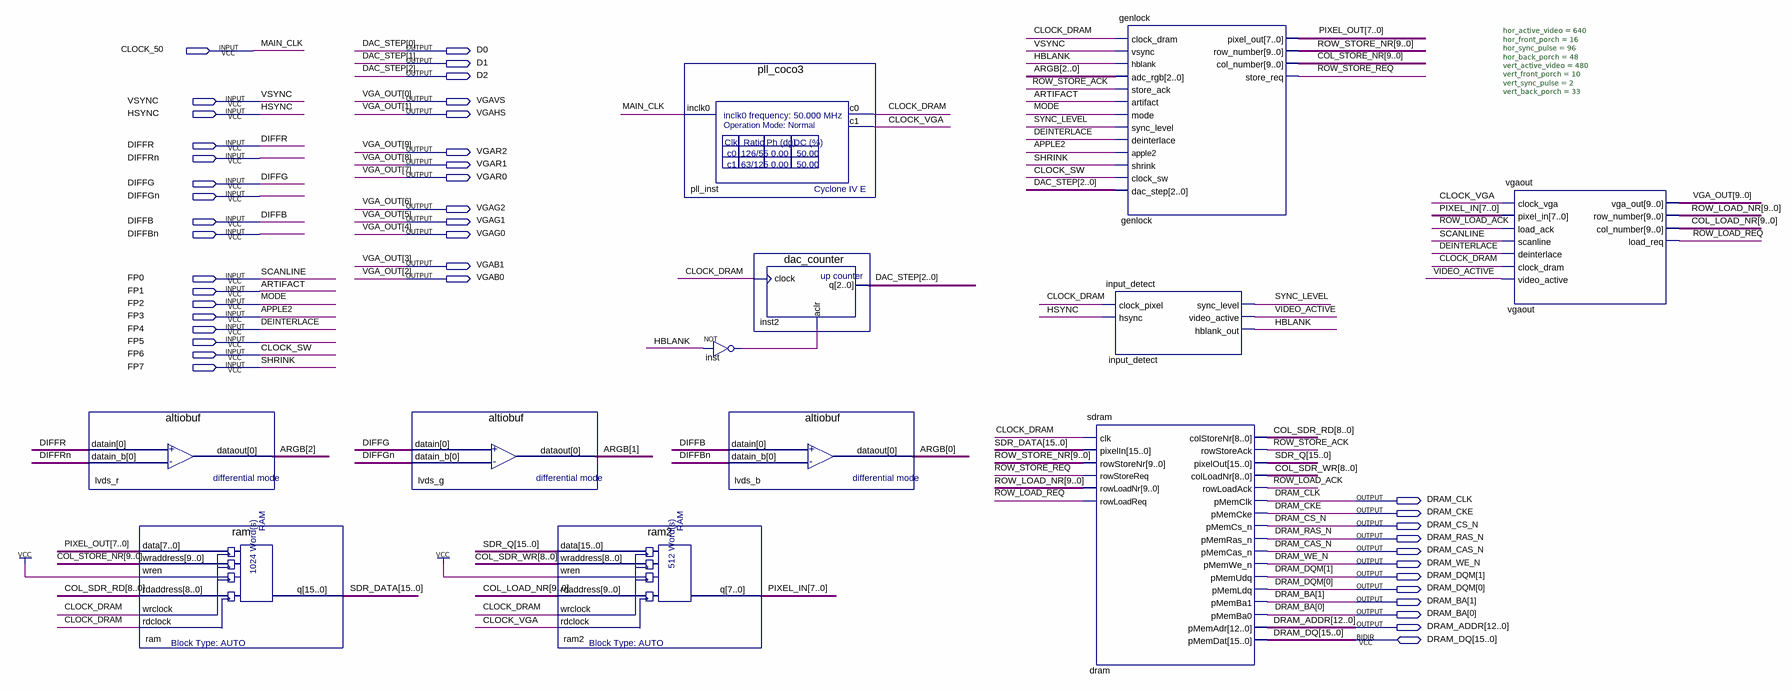
[diagram p0: schematic sheet]
// Quartus schematic top.bdf as structural Verilog: 12 symbols, 42 pins
module top (
  input  CLOCK_50,
  input  VSYNC,
  input  HSYNC,
  input  DIFFR,
  input  DIFFRn,
  input  DIFFG,
  input  DIFFGn,
  input  DIFFB,
  input  DIFFBn,
  input  FP0,
  input  FP1,
  input  FP2,
  input  FP3,
  input  FP4,
  input  FP5,
  input  FP6,
  input  FP7,
  inout  [15:0] DRAM_DQ,
  output D0,
  output D1,
  output D2,
  output VGAVS,
  output VGAHS,
  output VGAR2,
  output VGAR1,
  output VGAR0,
  output VGAG2,
  output VGAG1,
  output VGAG0,
  output VGAB1,
  output VGAB0,
  output DRAM_CLK,
  output DRAM_CKE,
  output DRAM_CS_N,
  output DRAM_RAS_N,
  output DRAM_CAS_N,
  output DRAM_WE_N,
  output [1:0] DRAM_DQM,
  output [1:0] DRAM_BA,
  output [12:0] DRAM_ADDR
);

  wire CLOCK_DRAM, CLOCK_VGA, HBLANK, inst_out, ROW_LOAD_ACK, ROW_LOAD_REQ, ROW_STORE_ACK, ROW_STORE_REQ,
       SYNC_LEVEL, VIDEO_ACTIVE;
  wire [2:0] ARGB;
  wire [7:0] PIXEL_IN, PIXEL_OUT;
  wire [8:0] COL_SDR_RD, COL_SDR_WR;
  wire [9:0] COL_LOAD_NR, COL_STORE_NR, ROW_LOAD_NR, ROW_STORE_NR;
  wire [15:0] SDR_DATA, SDR_Q;

  altiobuf lvds_r (.datain(DIFFR), .datain_b(DIFFRn), .dataout(ARGB[2]));
  ram ram (
    .data(PIXEL_OUT), .wraddress(COL_STORE_NR), .wren(1'b1), .rdaddress(COL_SDR_RD), .wrclock(CLOCK_DRAM),
    .rdclock(CLOCK_DRAM), .q(SDR_DATA));
  altiobuf lvds_g (.datain(DIFFG), .datain_b(DIFFGn), .dataout(ARGB[1]));
  ram2 ram2 (
    .data(SDR_Q), .wraddress(COL_SDR_WR), .wren(1'b1), .rdaddress(COL_LOAD_NR), .wrclock(CLOCK_DRAM),
    .rdclock(CLOCK_VGA), .q(PIXEL_IN));
  pll_coco3 pll_inst (.inclk0(CLOCK_50), .c0(CLOCK_DRAM), .c1(CLOCK_VGA));
  not inst (inst_out, HBLANK);
  altiobuf lvds_b (.datain(DIFFB), .datain_b(DIFFBn), .dataout(ARGB[0]));
  dac_counter inst2 (.clock(CLOCK_DRAM), .aclr(inst_out), .q({D2, D1, D0}));
  sdram dram (
    .clk(CLOCK_DRAM), .pixelIn(SDR_DATA), .rowStoreNr(ROW_STORE_NR), .rowStoreReq(ROW_STORE_REQ),
    .rowLoadNr(ROW_LOAD_NR), .rowLoadReq(ROW_LOAD_REQ), .colStoreNr(COL_SDR_RD), .rowStoreAck(ROW_STORE_ACK),
    .pixelOut(SDR_Q), .colLoadNr(COL_SDR_WR), .rowLoadAck(ROW_LOAD_ACK), .pMemClk(DRAM_CLK),
    .pMemCke(DRAM_CKE), .pMemCs_n(DRAM_CS_N), .pMemRas_n(DRAM_RAS_N), .pMemCas_n(DRAM_CAS_N),
    .pMemWe_n(DRAM_WE_N), .pMemUdq(DRAM_DQM[1]), .pMemLdq(DRAM_DQM[0]), .pMemBa1(DRAM_BA[1]),
    .pMemBa0(DRAM_BA[0]), .pMemAdr(DRAM_ADDR), .pMemDat(DRAM_DQ));
  genlock genlock (
    .clock_dram(CLOCK_DRAM), .vsync(VSYNC), .hblank(HBLANK), .adc_rgb(ARGB), .store_ack(ROW_STORE_ACK),
    .artifact(FP1), .mode(FP2), .sync_level(SYNC_LEVEL), .deinterlace(FP4), .apple2(FP3), .shrink(FP7),
    .clock_sw(FP6), .dac_step({D2, D1, D0}), .pixel_out(PIXEL_OUT), .row_number(ROW_STORE_NR),
    .col_number(COL_STORE_NR), .store_req(ROW_STORE_REQ));
  input_detect input_detect (
    .clock_pixel(CLOCK_DRAM), .hsync(HSYNC), .sync_level(SYNC_LEVEL), .video_active(VIDEO_ACTIVE),
    .hblank_out(HBLANK));
  vgaout #(.hor_active_video(640), .hor_front_porch(16), .hor_sync_pulse(96), .hor_back_porch(48), .vert_active_video(480), .vert_front_porch(10), .vert_sync_pulse(2), .vert_back_porch(33)) vgaout (
    .clock_vga(CLOCK_VGA), .pixel_in(PIXEL_IN), .load_ack(ROW_LOAD_ACK), .scanline(FP0), .deinterlace(FP4),
    .clock_dram(CLOCK_DRAM), .video_active(VIDEO_ACTIVE),
    .vga_out({VGAR2, VGAR1, VGAR0, VGAG2, VGAG1, VGAG0, VGAB1, VGAB0, VGAHS, VGAVS}),
    .row_number(ROW_LOAD_NR), .col_number(COL_LOAD_NR), .load_req(ROW_LOAD_REQ));

  // Other names for the same wires on the sheet: APPLE2 = FP3; ARTIFACT = FP1; CLOCK_SW = FP6;
  //   DAC_STEP[2:0] = {D2, D1, D0}; DEINTERLACE = FP4; MAIN_CLK = CLOCK_50; MODE = FP2; SCANLINE = FP0; SHRINK = FP7;
  //   VGA_OUT[9:0] = {VGAR2, VGAR1, VGAR0, VGAG2, VGAG1, VGAG0, VGAB1, VGAB0, VGAHS, VGAVS}
endmodule
